# EAGLE design TFF_1_0 (EAGLE 8.3.2)
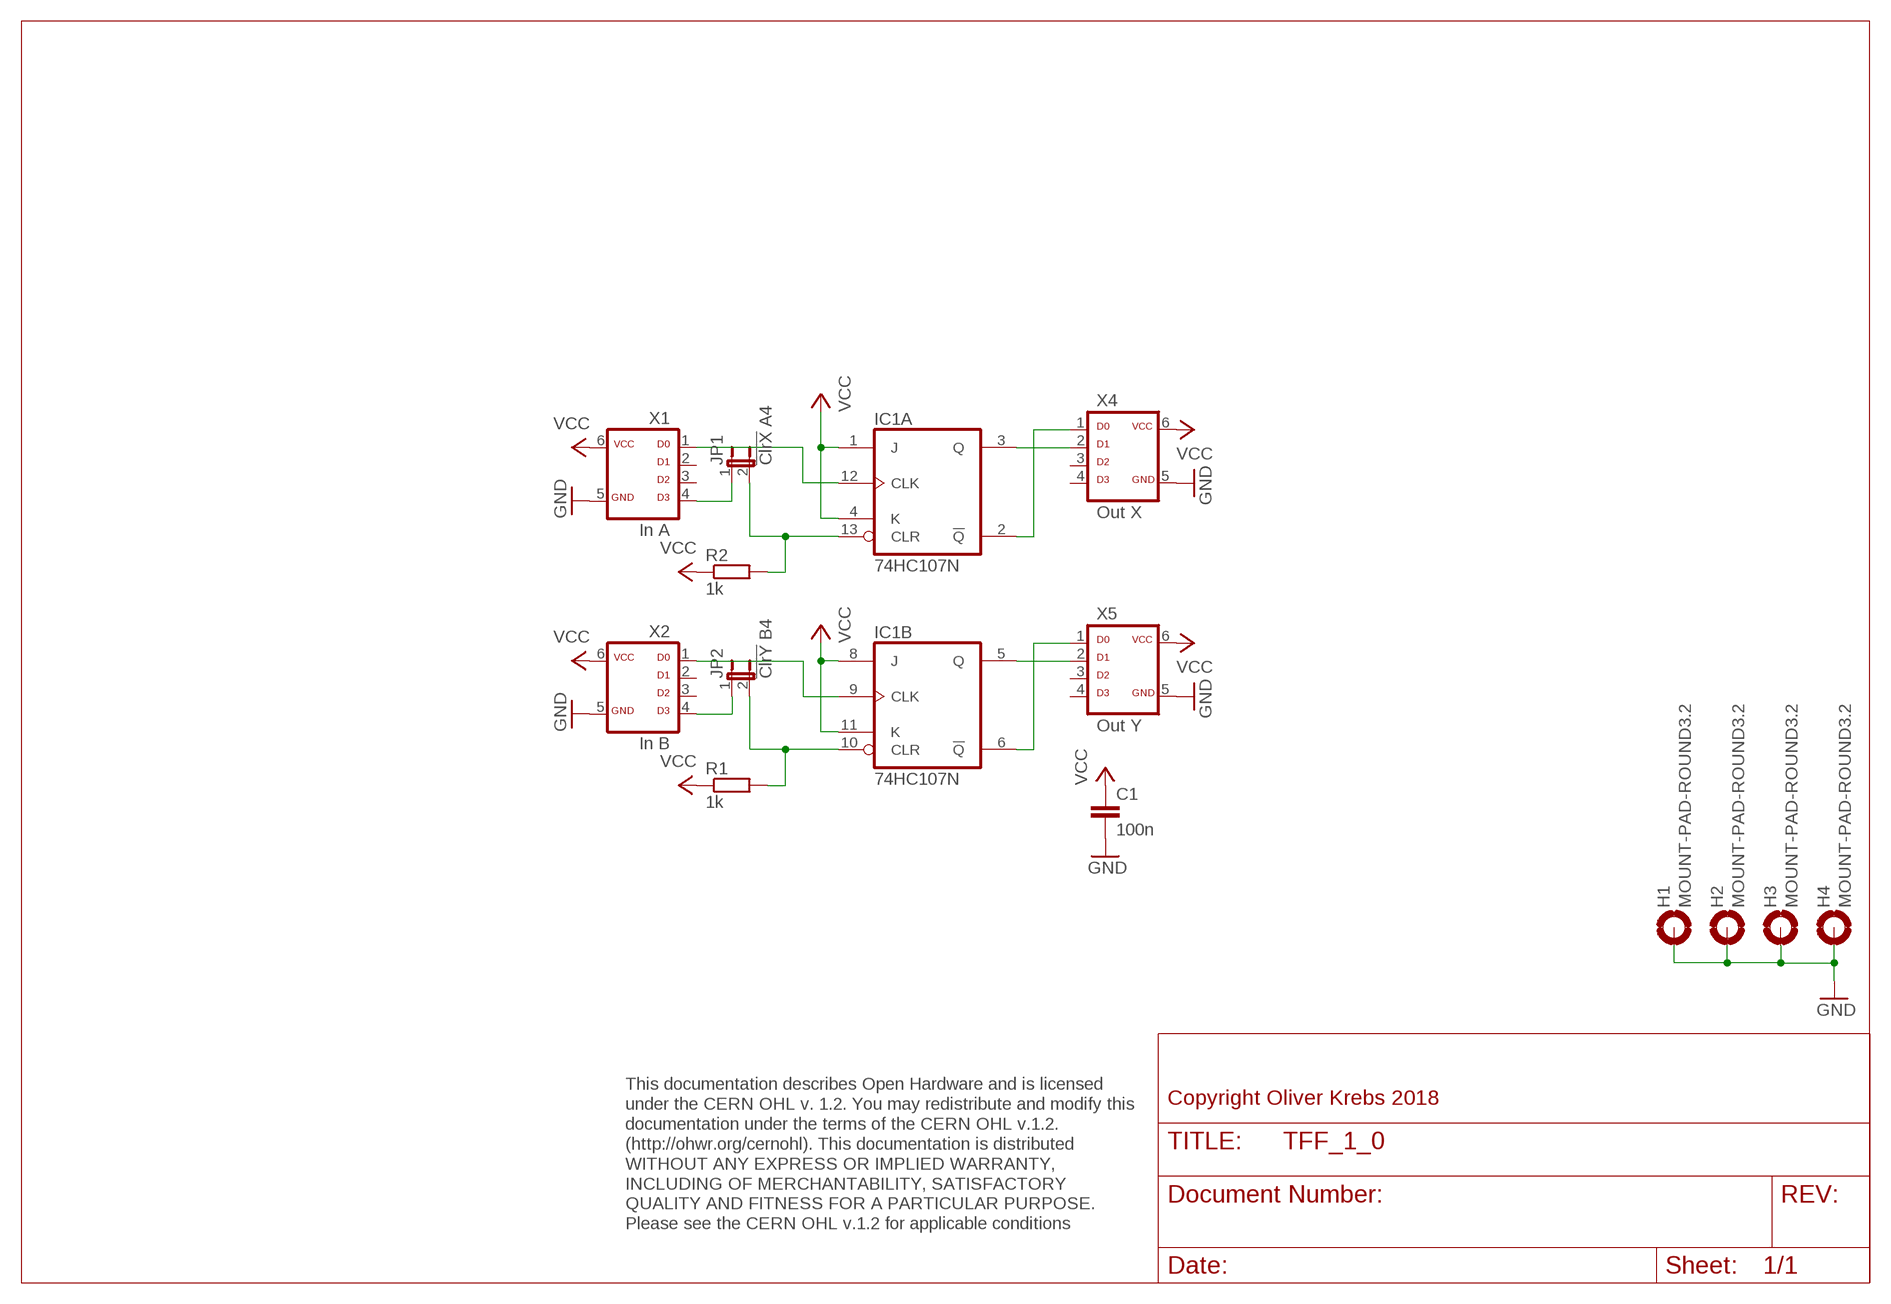
[diagram p0: schematic, sheet 1]

## Parts
C1  100n  C-EU050-025X075  [C050-025X075]
H1  MOUNT-PAD-ROUND3.2  [3,2-PAD]
H2  MOUNT-PAD-ROUND3.2  [3,2-PAD]
H3  MOUNT-PAD-ROUND3.2  [3,2-PAD]
H4  MOUNT-PAD-ROUND3.2  [3,2-PAD]
IC1  74HC107N  [DIL14]
JP1  !ClrX! A4  JP1E  [JP1]
JP2  !ClrY! B4  JP1E  [JP1]
R1  1k  R-EU_0207/10  [0207/10]
R2  1k  R-EU_0207/10  [0207/10]
X1  In A  ML6D  [ML-6]
X2  In B  ML6D  [ML-6]
X4  Out X  ML6D  [ML-6]
X5  Out Y  ML6D  [ML-6]

## Nets
GND: C1.2 H1.B3,2(MOUNT) H2.B3,2(MOUNT) H3.B3,2(MOUNT) H4.B3,2(MOUNT) X1.5 X2.5 X4.5 X5.5
N$1: IC1.13(A:CLR) JP1.2 R2.2
N$2: JP1.1 X1.4
N$3: JP2.1 X2.4
N$4: IC1.10(B:CLR) JP2.2 R1.2
N$5: IC1.9(B:CLK) X2.1
N$6: IC1.12(A:CLK) X1.1
N$7: IC1.2(A:!Q) X4.1
N$8: IC1.3(A:Q) X4.2
N$9: IC1.6(B:!Q) X5.1
N$10: IC1.5(B:Q) X5.2
VCC: C1.1 IC1.1(A:J) IC1.4(A:K) IC1.8(B:J) IC1.11(B:K) R1.1 R2.1 X1.6 X2.6 X4.6 X5.6
Unconnected: X1.2 X1.3 X2.2 X2.3 X4.3 X4.4 X5.3 X5.4

## Notes on the sheet
- Copyright Oliver Krebs 2018
- This documentation describes Open Hardware and is licensed 
  under the CERN OHL v. 1.2. You may redistribute and modify this 
  documentation under the terms of the CERN OHL v.1.2. 
  (http://ohwr.org/cernohl). This documentation is distributed
  WITHOUT ANY EXPRESS OR IMPLIED WARRANTY, 
  INCLUDING OF MERCHANTABILITY, SATISFACTORY 
  QUALITY AND FITNESS FOR A PARTICULAR PURPOSE. 
  Please see the CERN OHL v.1.2 for applicable conditions

## Power pins joined to a net without a drawn wire
GND: IC1.7(P:GND)
VCC: IC1.14(P:VCC)

## Library data of the parts
C1 = 01-my_rcl:C-EU: CAPACITOR, European symbol
H1-H4 = holes:MOUNT-PAD-ROUND: MOUNTING PAD, round
IC1 = 74xx-eu:74*107: Dual J-K FLIP FLOP, clear
JP1 JP2 = 01-my-jumper:JP1E: JUMPER
R1 R2 = 01-my_rcl:R-EU_: RESISTOR, European symbol
X1 X2 X4 X5 = 01-my-con:ML6D

## Board
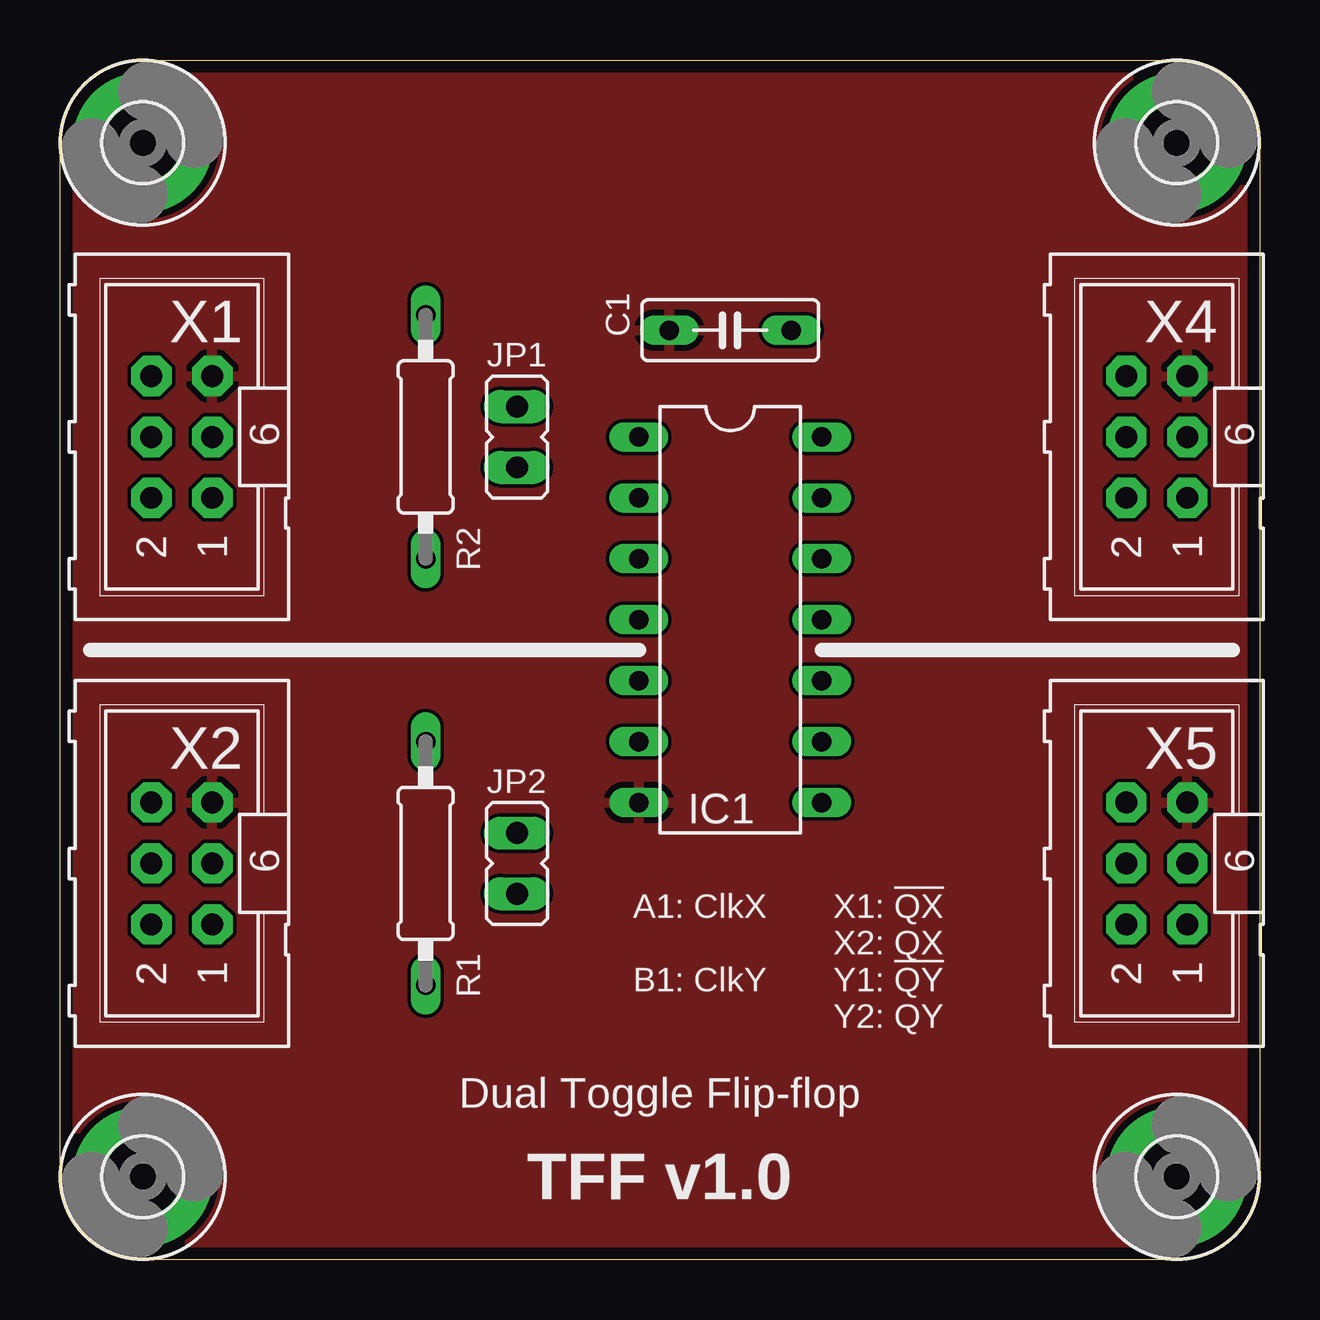
[diagram p1: board, top side]
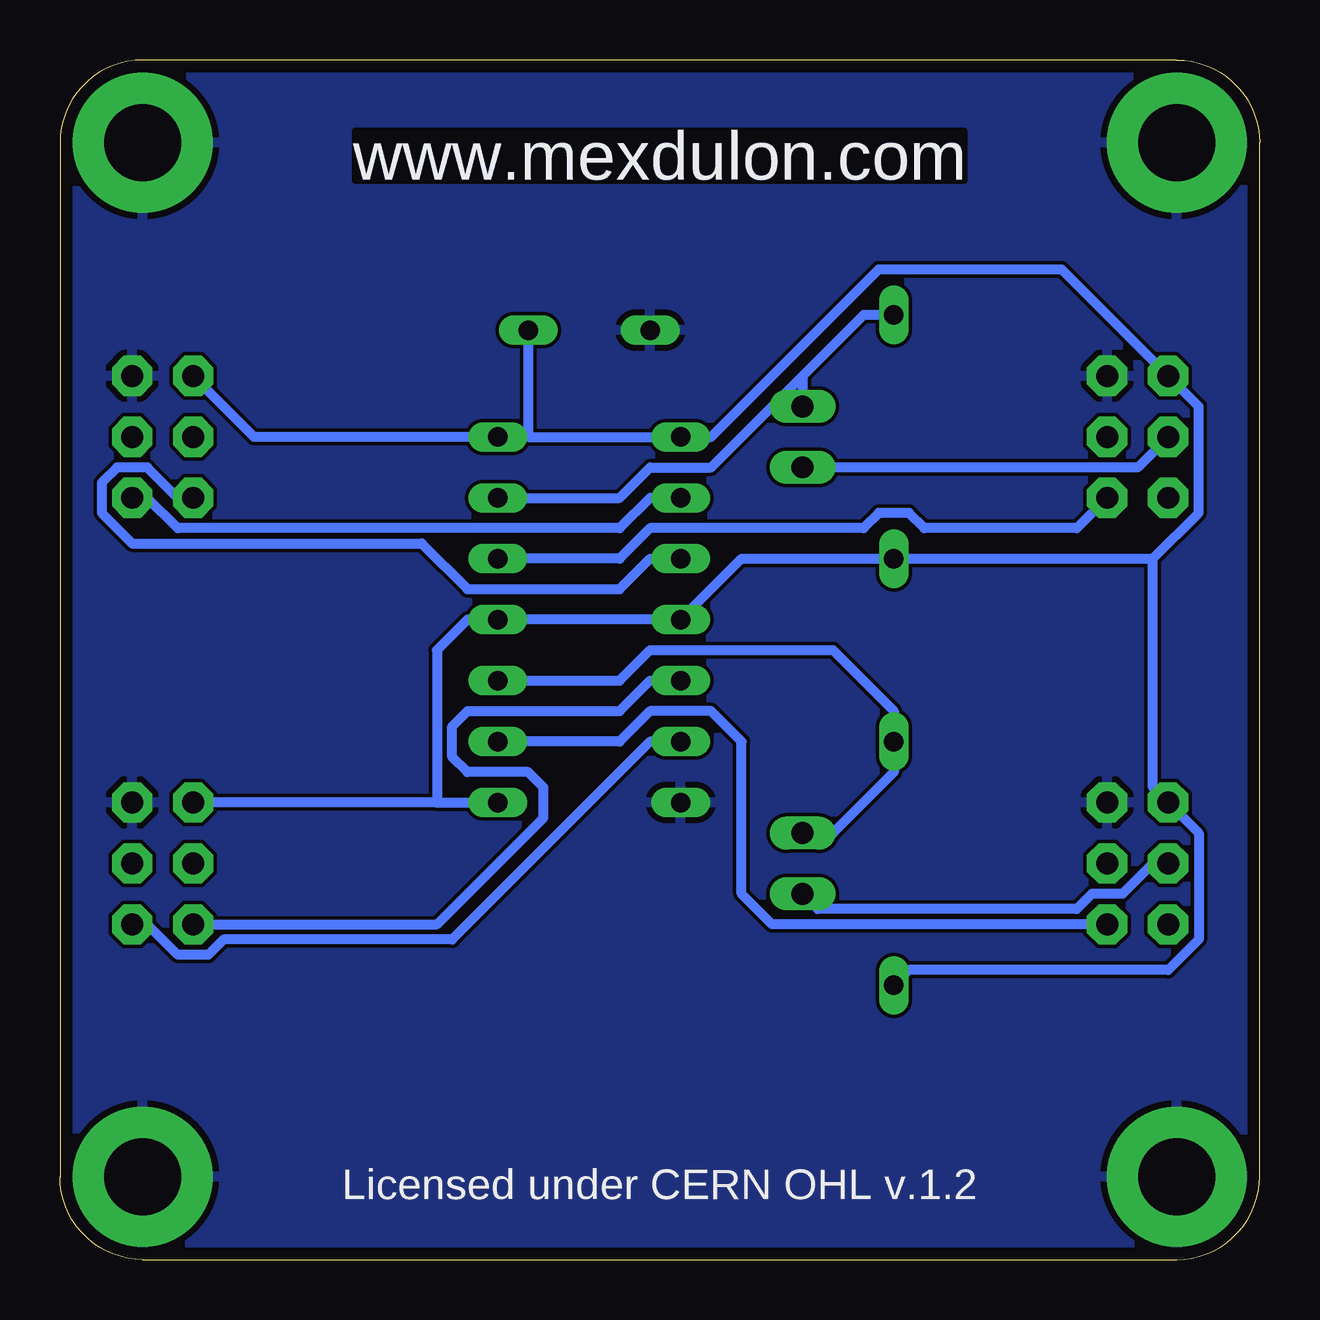
[diagram p2: board, bottom side, seen from below]

Size 50 x 50 mm. Coordinates in mm from the lower left corner, seen from the top.
Outline: 0,3.45 0,46.55 arc-90 3.45,50 46.55,50 arc-90 50,46.55 50,3.45 arc-90 46.55,0 3.45,0 arc-90 0,3.45
Copper layers (1*16): Top 0.035mm / dielectric 1.6mm / Bottom 0.035mm
Design rules "Elecrow_2-layer_PCB_eagle_rule": minimum track width 6mil, minimum drill 12mil, track to track 6mil, track to pad 6mil, pad to pad 6mil, via to via 8mil, smd to smd 0mil, copper to edge 20mil, drill to drill 10mil, minimum pad ring 6mil, minimum via ring 6mil, stop-mask expansion 0mil, vias tented up to drill 100mil, thermal gap 10mil

### Footprints (pad centres in the part's own frame; a part is rotated, then mirrored left to right if it is on the bottom)
C050-025X075 = drill 0.813 long: 1 -2.54,0; 2 2.54,0
3,2-PAD = drill 3.2 pad 5.842: B3,2 0,0
DIL14 = drill 0.813 long: 1 -7.62,-3.81; 2 -5.08,-3.81; 3 -2.54,-3.81; 4 0,-3.81; 5 2.54,-3.81; 6 5.08,-3.81; 7 7.62,-3.81; 8 7.62,3.81; 9 5.08,3.81; 10 2.54,3.81; 11 0,3.81; 12 -2.54,3.81; 13 -5.08,3.81; 14 -7.62,3.81
JP1 = drill 0.914 long: 1 0,-1.27; 2 0,1.27
0207/10 = drill 0.813 long: 1 -5.08,0; 2 5.08,0
ML-6 = drill 0.914 pad 1.676 octagon: 1 -2.54,-1.27; 2 -2.54,1.27; 3 0,-1.27; 4 0,1.27; 5 2.54,-1.27; 6 2.54,1.27

### Placement (x,y rotation side)
C1  27.94,38.73 180 top
H1  3.45,3.45 0 top
H2  3.45,46.55 0 top
H3  46.55,3.45 0 top
H4  46.55,46.55 0 top
IC1  27.94,26.67 270 top
JP1  19.05,34.29 0 top
JP2  19.05,16.51 0 top
R1  15.24,16.51 90 top
R2  15.24,34.29 90 top
X1  5.08,34.29 90 top
X2  5.08,16.51 90 top
X4  45.72,34.29 90 top
X5  45.72,16.51 90 top

### Tracks (layer width: path | path; a pad name or v marks a point on that pad's centre or on a via)
GND
  pour Bottom: -0.17,0 -0.17,50.16 50,50.16 50,0
  pour Top: -0.17,0 -0.17,50.16 50,50.16 50,0
N$1
  Bottom 0.406: R2.2 16.51,39.37 19.05,36.83 | IC1.13 26.67,31.75 25.4,33.02 22.86,33.02 19.05,36.83 | 19.05,36.83 JP1.2
N$2
  Bottom 0.406: X1.4 5.08,33.02 JP1.1
N$3
  Bottom 0.406: X2.4 4.45,16.51 5.71,15.24 6.99,15.24 7.62,14.61 18.41,14.61 JP2.1
N$4
  Bottom 0.406: JP2.2 17.78,17.78 15.24,20.32 R1.2 15.24,22.86 17.78,25.4 25.4,25.4 26.67,24.13 IC1.10
N$5
  Bottom 0.406: X2.1 20.32,13.97 21.59,15.24 21.59,21.59 22.86,22.86 25.4,22.86 26.67,21.59 IC1.9
N$6
  Bottom 0.406: IC1.12 26.67,29.21 25.4,30.48 16.51,30.48 15.88,31.11 14.61,31.11 13.97,30.48 7.62,30.48 X1.1
N$7
  Bottom 0.406: IC1.2 25.4,31.75 26.67,30.48 45.09,30.48 46.35,31.75 X4.1
N$8
  Bottom 0.406: X4.2 45.09,31.75 46.35,33.02 47.62,33.02 48.26,32.38 48.26,31.11 46.99,29.84 34.92,29.84 33.02,27.94 26.67,27.94 25.4,29.21 IC1.3
N$9
  Bottom 0.406: X5.1 46.35,13.97 45.09,12.7 43.81,12.7 43.18,13.34 33.66,13.34 25.4,21.59 IC1.6
N$10
  Bottom 0.406: X5.2 34.29,13.97 29.84,18.41 29.84,19.68 30.48,20.32 33.02,20.32 33.66,20.95 33.66,22.23 33.02,22.86 26.67,22.86 25.4,24.13 IC1.5
VCC
  Bottom 0.406: 4.45,29.21 2.54,31.11 2.54,35.56 X1.6 8.26,41.27 15.88,41.27 22.86,34.29 IC1.1 30.48,34.29 | 4.45,29.21 4.45,19.68 X2.6 2.54,17.78 2.54,13.34 3.81,12.06 14.61,12.06 R1.1 | 34.29,19.05 IC1.8 | 34.29,19.05 X5.6 | 30.48,34.29 IC1.14 41.91,34.29 X4.6 | C1.1 30.48,34.29 | 4.45,29.21 R2.1 21.59,29.21 IC1.4 IC1.11 33.02,26.67 34.29,25.4 34.29,19.05

### Text on the board
Bottom: www.mexdulon.com
tPlace: A1: ClkX / / B1: ClkY | X1: !QX! / X2: QX / Y1: !QY! / Y2: QY
bPlace: www.mexdulon.com
tNames: Dual Toggle Flip-flop | TFF v1.0
bNames: Licensed under CERN OHL v.1.2